# EAGLE design timer switch (EAGLE 9.6.2)
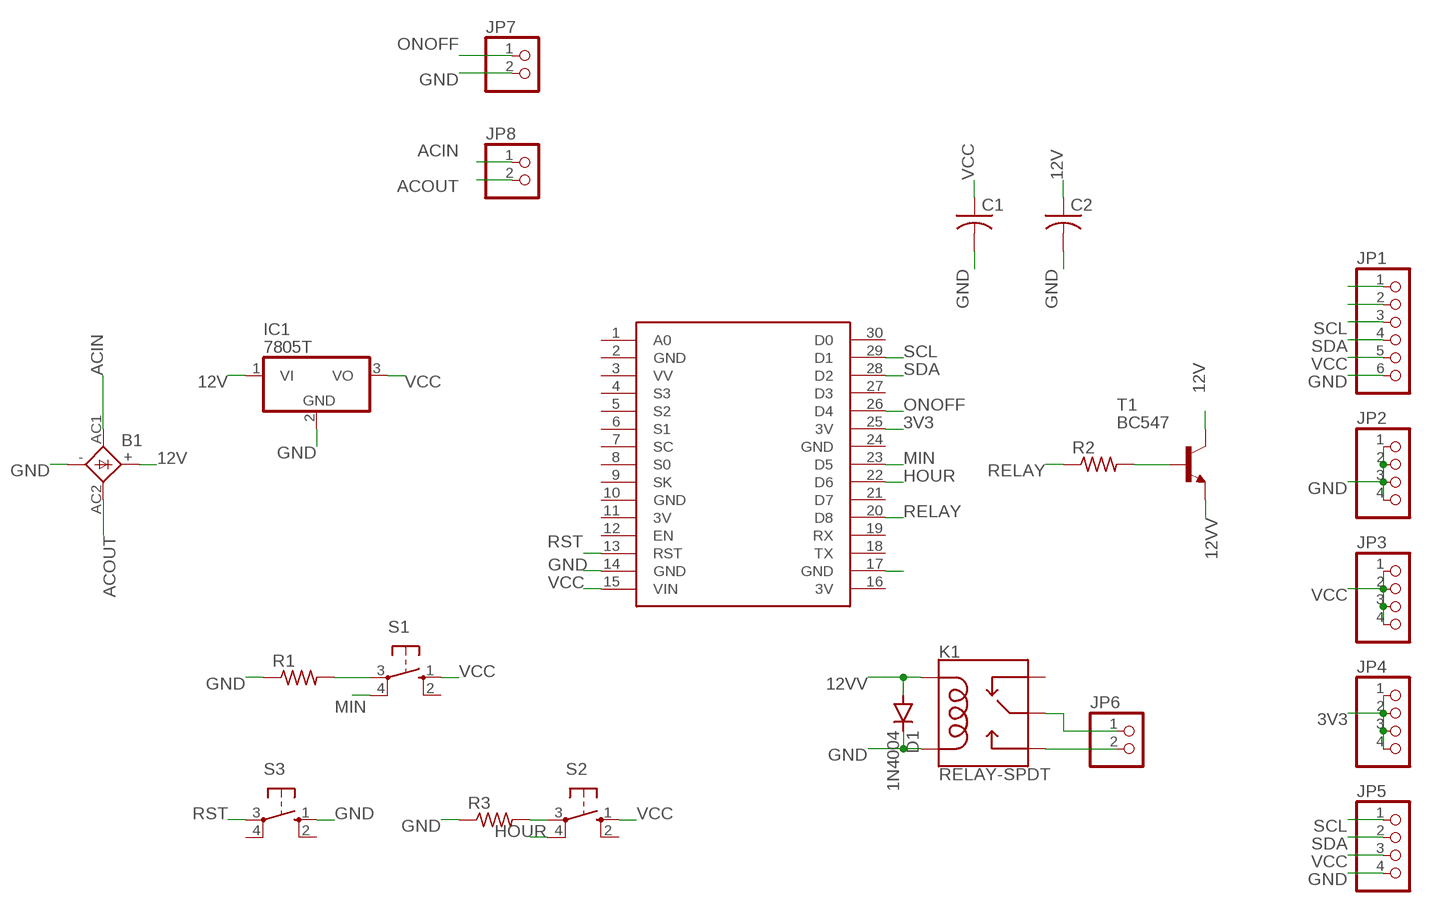
[diagram p0: schematic, sheet 1]

## Parts
B1  S41  [S41]
C1  C-US025-050X050  [C025-050X050]
C2  C-US025-050X050  [C025-050X050]
D1  1N4004  [DO41-10]
IC1  7805T  [TO220H]
JP1  PINHD-1X6  [1X06]
JP2  PINHD-1X4  [1X04]
JP3  PINHD-1X4  [1X04]
JP4  PINHD-1X4  [1X04]
JP5  PINHD-1X4  [1X04]
JP6  PINHD-1X2  [1X02]
JP7  PINHD-1X2  [1X02]
JP8  PINHD-1X2  [1X02]
K1  RELAY-SPDT  [RELAY_G5LE]
R1  R-US_0207/9  [0207/9]
R2  R-US_0207/9  [0207/9]
R3  R-US_0207/9  [0207/9]
S1  10-XX  [B3F-10XX]
S2  10-XX  [B3F-10XX]
S3  10-XX  [B3F-10XX]
T1  BC547  [TO92]
U$1  NODEMCU  [NODEMCU]

## Nets
3V3: JP4.1 JP4.2 JP4.3 JP4.4 U$1.25(3V)
12V: B1.+ C2.1 IC1.1(VI) T1.3(C)
12VV: D1.A K1.2(COIL1) T1.1(E)
ACIN: B1.AC1 JP8.1
ACOUT: B1.AC2 JP8.2
GND: B1.- C1.2 C2.2 D1.C IC1.2(GND) JP1.6 JP2.1 JP2.2 JP2.3 JP2.4 JP5.4 JP7.2 K1.5(COIL2) R1.1 R3.1 S3.1(S) U$1.14(GND)
HOUR: S2.4(P1) U$1.22(D6)
MIN: S1.4(P1) U$1.23(D5)
N$1: JP6.1 K1.1(MAIN)
N$2: JP6.2 K1.3(NO)
N$3: U$1.17(GND)
N$5: JP1.1
N$6: JP1.2
N$7: R2.2 T1.2(B)
N$15: R1.2 S1.3(P)
N$16: R3.2 S2.3(P)
ONOFF: JP7.1 U$1.26(D4)
RELAY: R2.1 U$1.20(D8)
RST: S3.3(P) U$1.13(RST)
SCL: JP1.3 JP5.1 U$1.29(D1)
SDA: JP1.4 JP5.2 U$1.28(D2)
VCC: C1.1 IC1.3(VO) JP1.5 JP3.1 JP3.2 JP3.3 JP3.4 JP5.3 S1.1(S) S2.1(S) U$1.15(VIN)
Unconnected: K1.4(NC) S1.2(S1) S2.2(S1) S3.2(S1) S3.4(P1) U$1.1(A0) U$1.3(VV) U$1.4(S3) U$1.5(S2) U$1.6(S1) U$1.7(SC) U$1.8(S0) U$1.9(SK) U$1.12(EN) U$1.18(TX) U$1.19(RX) U$1.21(D7) U$1.27(D3) U$1.30(D0)

## Power pins joined to a net without a drawn wire
3V: U$1.11(3V) U$1.16(3V)
GND: U$1.2(GND) U$1.10(GND) U$1.24(GND)

## Library data of the parts
B1 = rectifier:S41: SEMIKRON RECTIFIER
C1 C2 = adafruit:C-US: CAPACITOR, American symbol
D1 = diode:1N4004: DIODE general purpose rectifier, 1 A
IC1 = linear:78*: Positive VOLTAGE REGULATOR Source: http://cache.national.com/ds/LM/LM78L05.pdf http://www.fairchildsemi.com/ds/LM/LM7805.pdf
JP1 = adafruit:PINHD-1X6: PIN HEADER
JP2-JP5 = pinhead:PINHD-1X4: PIN HEADER
JP6-JP8 = pinhead:PINHD-1X2: PIN HEADER
K1 = SparkFun-Electromechanical:RELAY-SPDT: SPDT Electromechanical Relay Single-pole, double-throw sealed relays. When current is applied to the coil, it throws a simple changeover switch, terminating the connection from the NC contact to ground and closing the NO contact. Use them to switch high voltage/high current devices. SparkFun Products JQX-15F: Relay SPDT Sealed - 20A <https://www.sparkfun.com/products/10924> (COM-10924) JZC-11F: Relay SPDT Sealed <https://www.sparkfun.com/products/100> (COM-00100); PROD_ID: COMP-14214
R1-R3 = adafruit:R-US_: RESISTOR, American symbol
S1-S3 = switch-omron:10-XX: OMRON SWITCH; MPN: B3F-1000; OC_FARNELL: 176432; OC_NEWARK: 36M3542
T1 = transistor:BC547: NPN TRANSISTOR
U$1 = nodemcu:NODEMCU

## Board
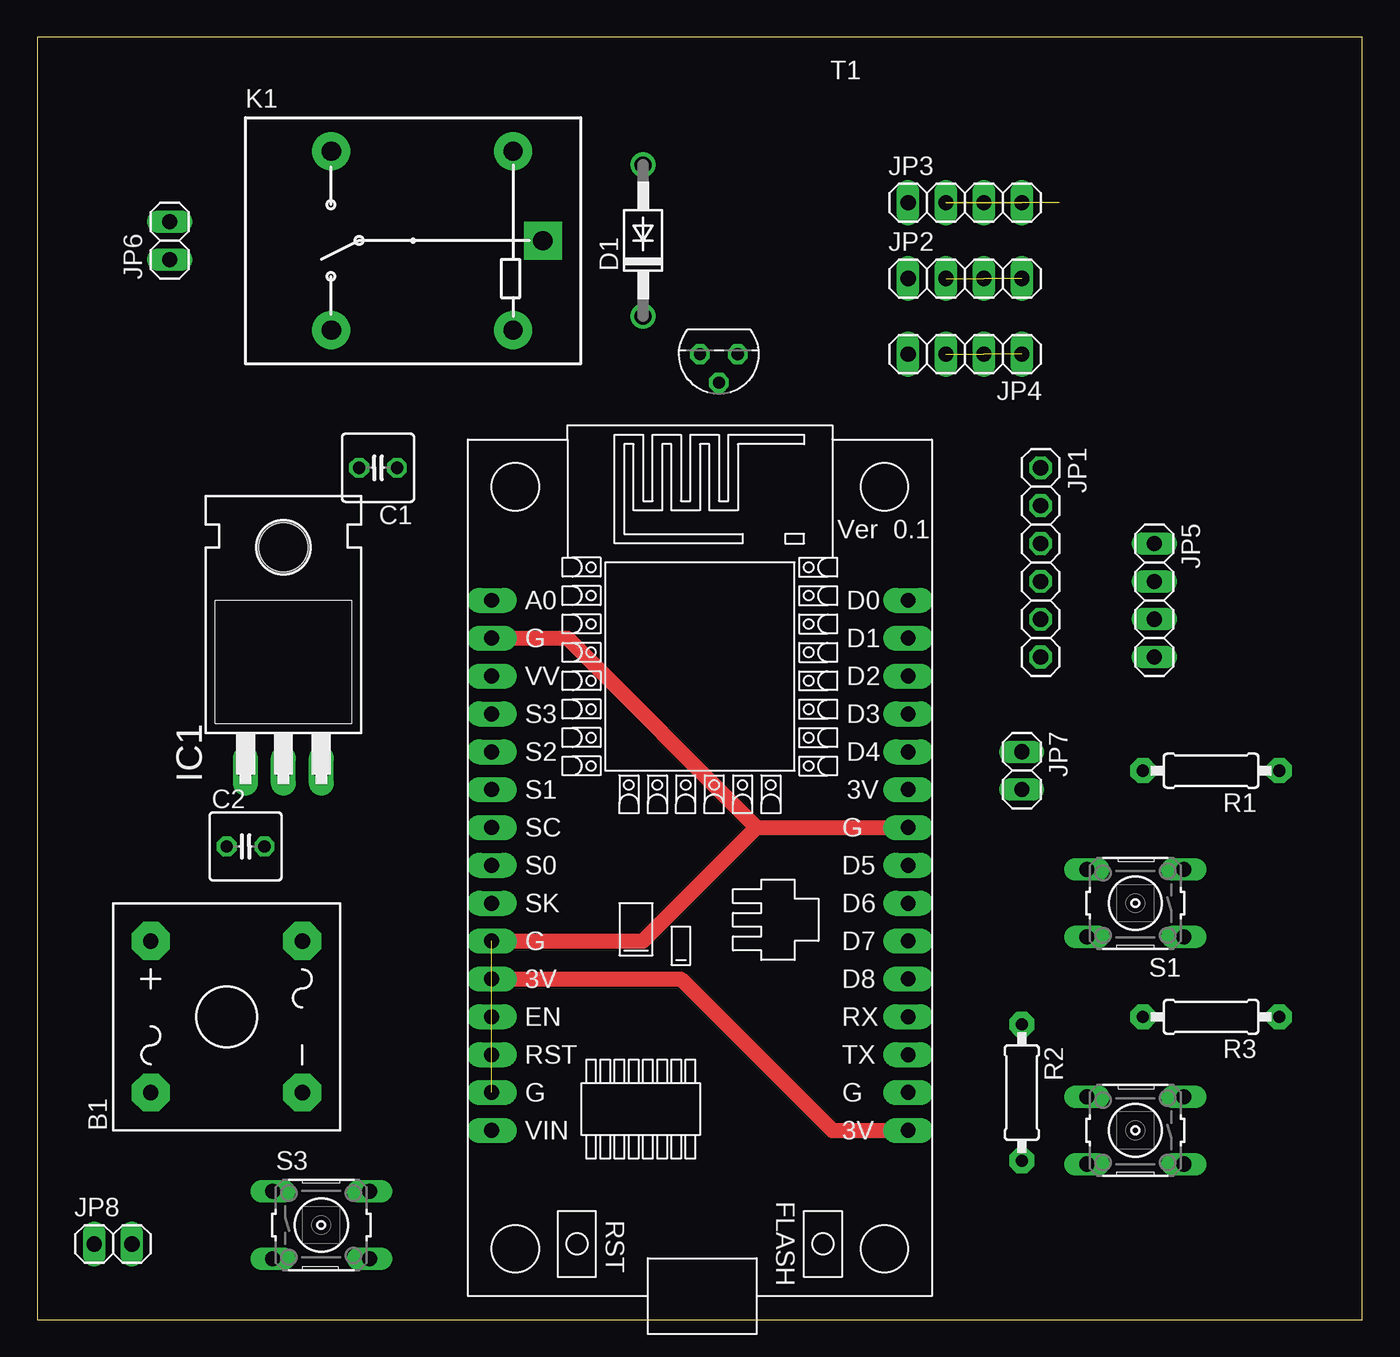
[diagram p1: board, top side]
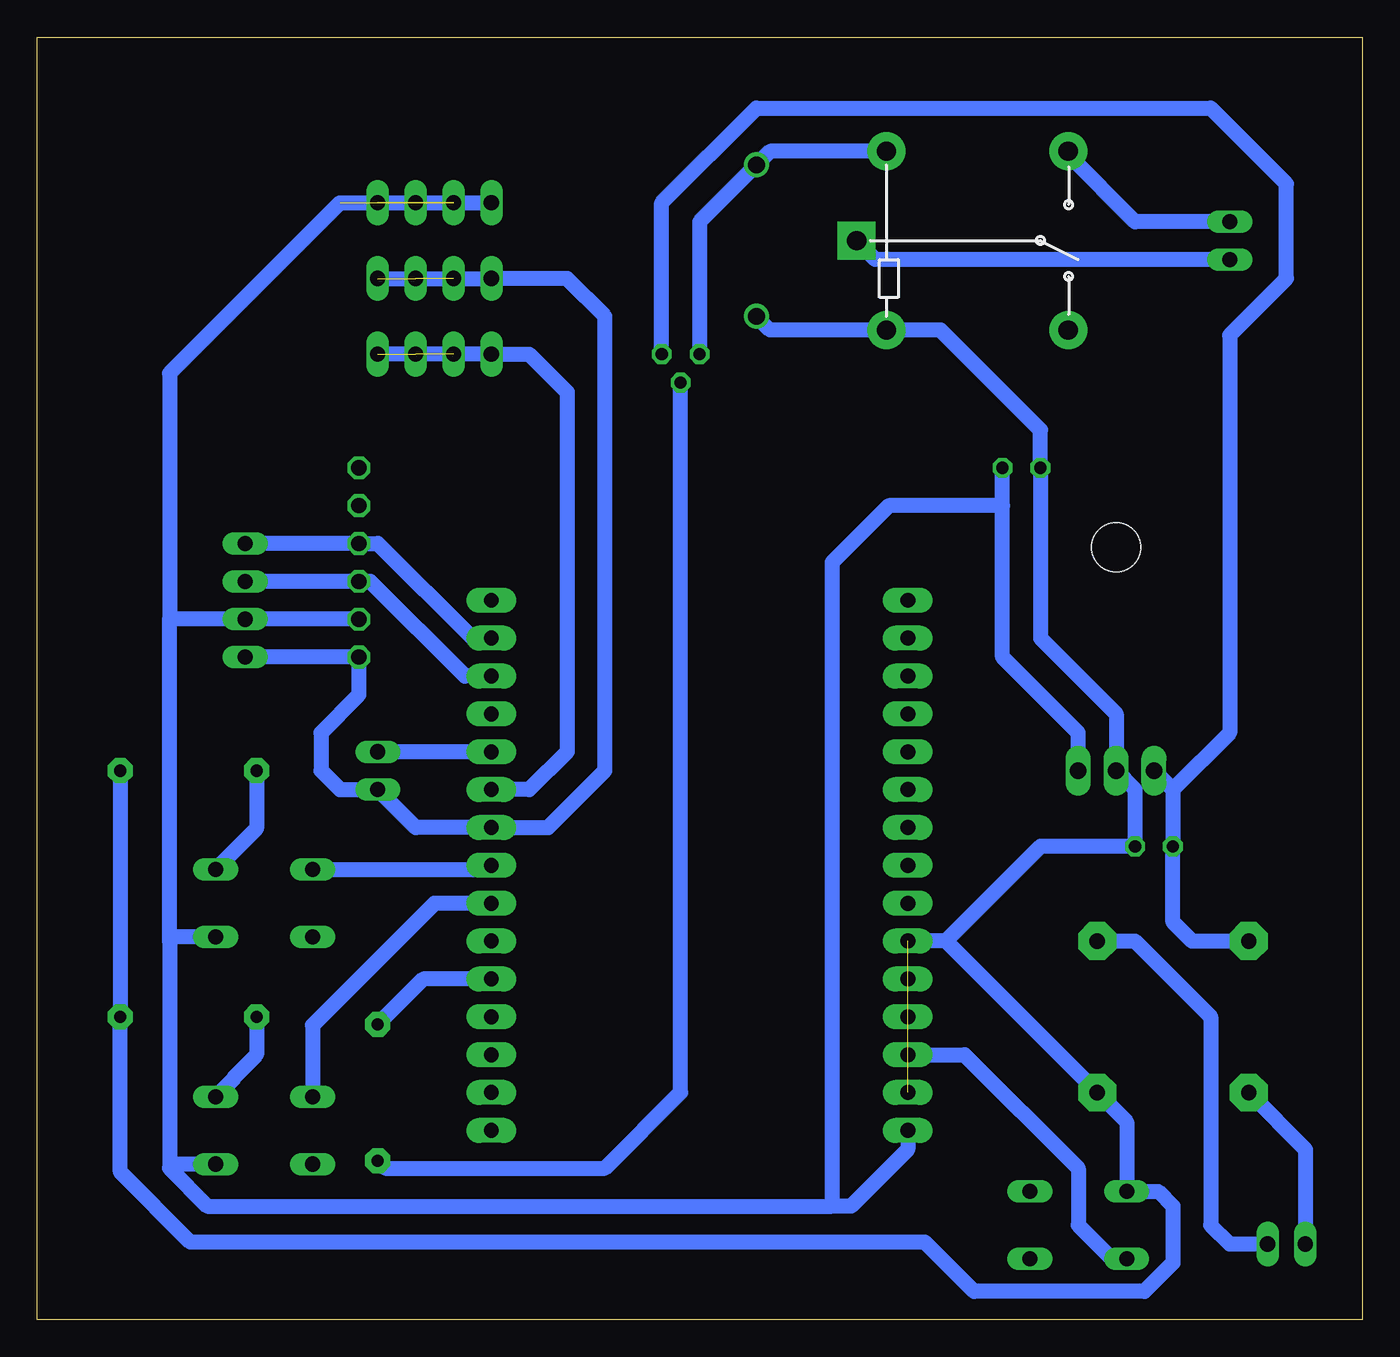
[diagram p2: board, bottom side, seen from below]

Size 88.88 x 86.03 mm. Coordinates in mm from the lower left corner, seen from the top.
Outline: 0,0 88.88,0 88.88,86.03 0,86.03 0,0
Copper layers (1*16): Top 0.035mm / dielectric 1.5mm / Bottom 0.035mm
Design rules "default": minimum track width 6mil, minimum drill 0.35mm, track to track 6mil, track to pad 6mil, pad to pad 6mil, via to via 6mil, smd to smd 6mil, copper to edge 40mil, drill to drill 6mil, minimum pad ring 10mil, minimum via ring 8mil, stop-mask expansion 4mil, vias tented up to drill 0mil, thermal gap 10mil

### Footprints (pad centres in the part's own frame; a part is rotated, then mirrored left to right if it is on the bottom)
S41 = drill 1.016 pad 2.54 octagon: + 5.08,5.08; - -5.08,-5.08; AC1 -5.08,5.08; AC2 5.08,-5.08
C025-050X050 = drill 0.813 octagon: 1 -1.27,0; 2 1.27,0
DO41-10 = drill 1.118: A 5.08,0; C -5.08,0
TO220H = drill 1.118 long: 1 -2.54,-10.16; 2 0,-10.16; 3 2.54,-10.16 | hole 3.302: 0,4.826
1X06 = drill 1.016 octagon: 1 -6.35,0; 2 -3.81,0; 3 -1.27,0; 4 1.27,0; 5 3.81,0; 6 6.35,0
1X04 = drill 1.016 long: 1 -3.81,0; 2 -1.27,0; 3 1.27,0; 4 3.81,0
1X02 = drill 1.016 long: 1 -1.27,0; 2 1.27,0
RELAY_G5LE = drill 1.3 pad 2.54 square: 1 8.52,-0.005 | drill 1.3 pad 2.54: 2 6.52,5.995; 3 -5.68,5.995; 4 -5.68,-6.005; 5 6.52,-6.005
0207/9 = drill 0.813 pad 1.676 octagon: 1 -4.572,0; 2 4.572,0
B3F-10XX = drill 1.016 long: 1 -3.251,2.261; 2 3.251,2.261; 3 -3.251,-2.261; 4 3.251,-2.261
TO92 = drill 0.813 octagon: 1 1.27,0; 2 0,1.905; 3 -1.27,0
NODEMCU = drill 1 pad 1.676 long: 1 -13.97,17.78; 2 -13.97,15.24; 3 -13.97,12.7; 4 -13.97,10.16; 5 -13.97,7.62; 6 -13.97,5.08; 7 -13.97,2.54; 8 -13.97,0; 9 -13.97,-2.54; 10 -13.97,-5.08; 11 -13.97,-7.62; 12 -13.97,-10.16; 13 -13.97,-12.7; 14 -13.97,-15.24; 15 -13.97,-17.78; 16 13.97,-17.78; 17 13.97,-15.24; 18 13.97,-12.7; 19 13.97,-10.16; 20 13.97,-7.62; 21 13.97,-5.08; 22 13.97,-2.54; 23 13.97,0; 24 13.97,2.54; 25 13.97,5.08; 26 13.97,7.62; 27 13.97,10.16; 28 13.97,12.7; 29 13.97,15.24; 30 13.97,17.78

### Placement (x,y rotation side)
B1  12.7,20.32 90 top
C1  22.86,57.15 180 top
C2  13.97,31.75 0 top
D1  40.64,72.39 90 top
IC1  16.51,46.99 0 top
JP1  67.31,50.8 270 top
JP2  62.23,69.85 0 top
JP3  62.23,74.93 0 top
JP4  62.23,64.77 180 top
JP5  74.93,48.26 270 top
JP6  8.89,72.39 90 top
JP7  66.04,36.83 270 top
JP8  5.08,5.08 0 top
K1  25.4,72.39 0 top
R1  78.74,36.83 180 top
R2  66.04,15.24 270 top
R3  78.74,20.32 180 top
S1  73.66,27.94 180 top
S2  73.66,12.7 180 top
S3  19.05,6.35 0 top
T1  45.72,64.77 180 top
U$1  44.45,30.48 0 top

### Tracks (layer width: path | path; a pad name or v marks a point on that pad's centre or on a via)
3V
  Top 1.016: U$1.11 43.18,22.86 53.34,12.7 U$1.16
3V3  (2 unrouted)
  Bottom 1.016: U$1.25 55.88,35.56 53.34,38.1 53.34,62.23 55.88,64.77 JP4.4 JP4.1
12V
  Bottom 1.016: B1.+ 11.43,25.4 12.7,26.67 C2.1 12.7,35.56 | 12.7,35.56 IC1.1 | T1.3 46.99,74.93 40.64,81.28 10.16,81.28 5.08,76.2 5.08,69.85 8.89,66.04 8.89,39.37 12.7,35.56
12VV
  Bottom 1.016: K1.2 39.73,78.39 D1.A 44.45,73.66 T1.1
ACIN
  Bottom 1.016: B1.AC1 3.81,11.43 JP8.1
ACOUT
  Bottom 1.016: B1.AC2 15.24,25.4 10.16,20.32 10.16,6.35 8.89,5.08 JP8.2
GND  (3 unrouted)
  Top 1.016: U$1.2 35.56,45.72 48.26,33.02 | 48.26,33.02 U$1.24 | U$1.10 40.64,25.4 48.26,33.02
  Bottom 1.016: 27.94,25.4 B1.- 15.8,13.26 S3.1 13.69,8.61 12.7,7.62 12.7,3.81 14.61,1.91 26.04,1.91 29.34,5.21 78.61,5.21 83.31,9.91 R3.1 R1.1 | 27.94,25.4 U$1.10 | D1.C 39.72,66.39 K1.5 28.29,66.39 21.59,59.69 C1.2 21.59,45.72 16.51,40.64 IC1.2 15.24,35.56 C2.2 21.59,31.75 27.94,25.4 | JP2.4 JP2.1 53.34,69.85 50.8,67.31 50.8,36.83 54.61,33.02 U$1.24 63.5,33.02 JP7.2 68.58,35.56 69.85,36.83 69.85,39.37 67.31,41.91 JP1.6 JP5.4
HOUR
  Bottom 1.016: U$1.22 62.23,27.94 70.41,19.76 S2.4
MIN
  Bottom 1.016: S1.4 58.7,30.2 U$1.23
N$1
  Bottom 1.016: K1.1 32.66,71.12 JP6.1
N$2
  Bottom 1.016: JP6.2 15.24,73.66 19.72,78.14 K1.3
N$7
  Bottom 1.016: R2.2 65.53,10.16 50.8,10.16 45.72,15.24 T1.2
N$15
  Bottom 1.016: R1.2 74.17,32.94 S1.3
N$16
  Bottom 1.016: R3.2 74.17,17.78 75.64,16.31 75.64,16.23 S2.3
ONOFF
  Bottom 1.016: U$1.26 JP7.1
RELAY
  Bottom 1.016: R2.1 62.99,22.86 U$1.20
RST
  Bottom 1.016: U$1.13 26.67,17.78 19.05,10.16 19.05,6.35 16.79,4.09 S3.3
SCL
  Bottom 1.016: U$1.29 59.69,45.72 66.04,52.07 JP1.3 JP5.1
SDA
  Bottom 1.016: U$1.28 60.2,43.18 66.55,49.53 JP1.4 JP5.2
VCC  (3 unrouted)
  Bottom 1.016: 24.13,54.61 24.13,44.45 19.05,39.37 IC1.3 | 24.13,54.61 C1.1 | U$1.15 30.48,11.43 34.29,7.62 35.56,7.62 | 24.13,54.61 31.75,54.61 35.56,50.8 35.56,7.62 | 35.56,7.62 77.47,7.62 80.01,10.16 | S1.1 79.73,25.68 80.01,25.4 | 80.01,25.4 80.01,10.16 | S2.1 79.73,10.44 80.01,10.16 | JP3.1 68.58,74.93 80.01,63.5 80.01,46.99 | JP1.5 JP5.3 80.01,46.99 | 80.01,25.4 80.01,46.99